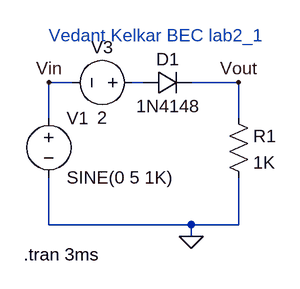
[diagram p0: schematic Draft15.asc]
Draft15.asc, the LTspice schematic file:
Version 4
SHEET 1 880 680
WIRE 96 96 64 96
WIRE 192 96 176 96
WIRE 320 96 256 96
WIRE 64 144 64 96
WIRE 320 144 320 96
WIRE 64 288 64 224
WIRE 256 288 64 288
WIRE 320 288 320 224
WIRE 320 288 256 288
WIRE 256 304 256 288
FLAG 64 96 Vin
FLAG 320 96 Vout
FLAG 256 304 0
SYMBOL voltage 64 128 R0
WINDOW 123 0 0 Left 0
WINDOW 39 0 0 Left 0
SYMATTR InstName V1
SYMATTR Value SINE(0 5 1K)
SYMBOL diode 192 112 R270
WINDOW 0 32 32 VTop 2
WINDOW 3 0 32 VBottom 2
SYMATTR InstName D1
SYMATTR Value 1N4148
SYMBOL res 304 128 R0
SYMATTR InstName R1
SYMATTR Value 1K
SYMBOL voltage 192 96 R90
WINDOW 0 -32 56 VBottom 2
WINDOW 3 32 56 VTop 2
WINDOW 123 0 0 Left 0
WINDOW 39 0 0 Left 0
SYMATTR InstName V3
SYMATTR Value 2
TEXT 64 32 Left 2 ;Vedant Kelkar BEC lab2_1
TEXT 30 328 Left 2 !.tran 3ms

The netlist it stands for:
* Draft15.asc
V1 Vin 0 SINE(0 5 1K)
D1 N001 Vout 1N4148
R1 Vout 0 1K
V3 N001 Vin 2
.model D D
.lib standard.dio
* Vedant Kelkar BEC lab2_1
.tran 3ms
.backanno
.end